# EAGLE design FogMachineTimer_revB (EAGLE 9.5.0)
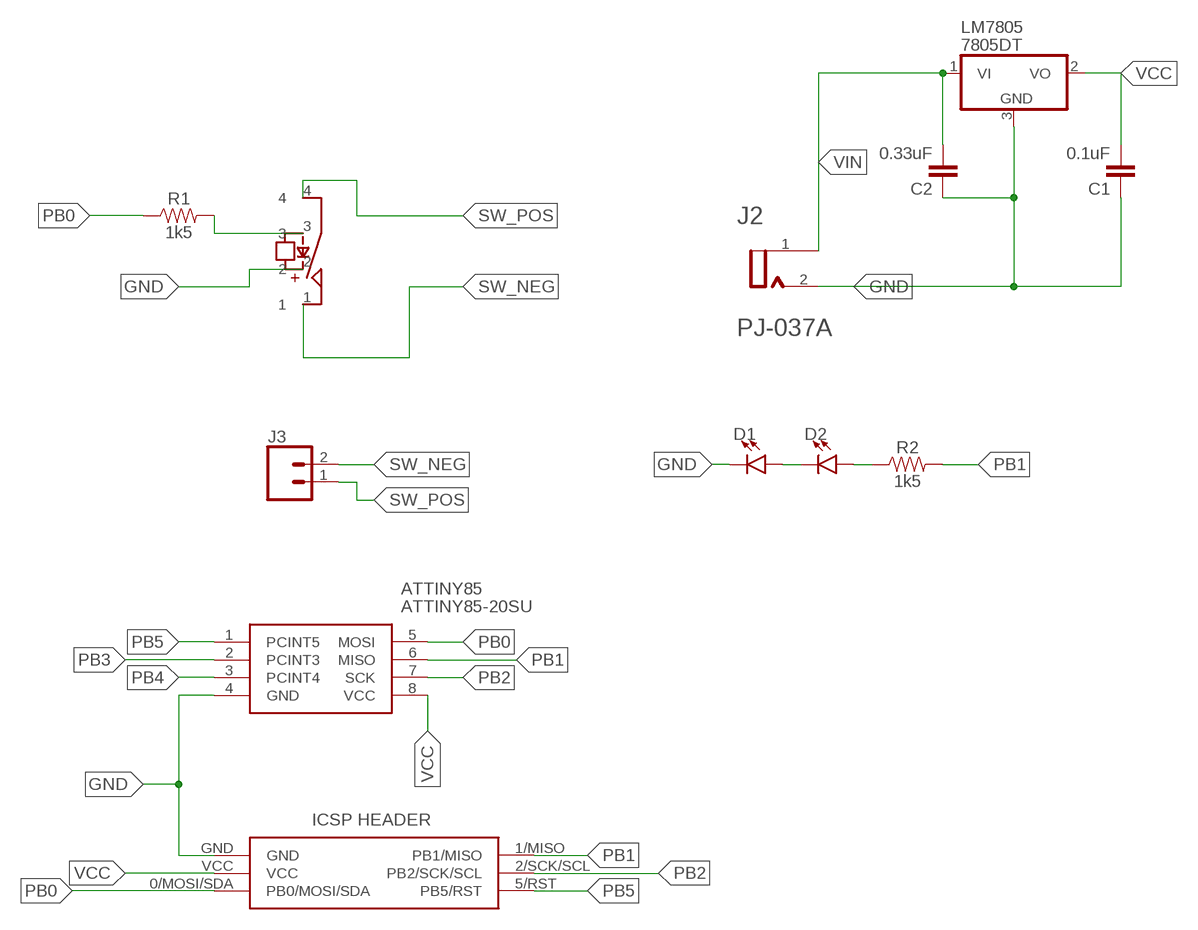
[diagram p0: schematic, sheet 1]

## Parts
ATTINY85  ATTINY85-20SU  [SOT127P798X216-8N]
C1  0.1uF  0.1UF-0603-25V-5%  [0603]
C2  0.33uF  0.1UF-0603-25V-5%  [0603]
D1  LED1206  [LED-1206]
D2  LED1206  [LED-1206]
J1  M20-9980346  [HDRV6W64P254_2X3_762X508X868P]
J2  CUI_PJ-037ACUI_PJ-037A_0_0  [CUI_PJ-037A_0]
J3  CONN_02  [1X02]
LM7805  7805DT  [TO252]
R1  1k5  1KOHM-0603-1/10W-1%  [0603]
R2  1k5  1KOHM-0603-1/10W-1%  [0603]
RELAY  HE3621A0510  [HE3621A0510]

## Nets
GND: ATTINY85.4(GND) C1.1 C2.1 D1.C J1.GND J2.2 LM7805.3(GND) RELAY.2
N$1: D1.A D2.C
N$2: D2.A R2.1
N$3: R1.2 RELAY.3
PB0: ATTINY85.5(MOSI) J1.0/MOSI/SDA(PB0/MOSI/SDA) R1.1
PB1: ATTINY85.6(MISO) J1.1/MISO(PB1/MISO) R2.2
PB2: ATTINY85.7(SCK) J1.2/SCK/SCL(PB2/SCK/SCL)
PB3: ATTINY85.2(PCINT3)
PB4: ATTINY85.3(PCINT4)
PB5: ATTINY85.1(PCINT5) J1.5/RST(PB5/RST)
SW_NEG: J3.2 RELAY.1
SW_POS: J3.1 RELAY.4
VCC: ATTINY85.8(VCC) C1.2 J1.VCC LM7805.2(VO)
VIN: C2.2 J2.1 LM7805.1(VI)

## Library data of the parts
ATTINY85 = NickParts:ATTINY85-20SU: MICROCHIP - ATTINY85-20SU - MICROCONTROLLER MCU, 8 BIT, ATTINY, 20MHZ, SOIC-8 Source: Datasheet <https://componentsearchengine.com/Datasheets/2/ATTINY85-20SU.pdf>; ARROW_PART_NUMBER: ATTINY85-20SU; ARROW_PRICE/STOCK: https://www.arrow.com/en/products/attiny85-20su/microchip-technology; DESCRIPTION: MICROCHIP - ATTINY85-20SU - MICROCONTROLLER MCU, 8 BIT, ATTINY, 20MHZ, SOIC-8; HEIGHT: 2.16mm; MANUFACTURER_NAME: Microchip; MANUFACTURER_PART_NUMBER: ATTINY85-20SU; RS_PART_NUMBER: 1331674; RS_PRICE/STOCK: http://uk.rs-online.com/web/p/products/1331674
C1 = SparkFun-Capacitors:0.1UF: 0.1µF ceramic capacitors A capacitor is a passive two-terminal electrical component used to store electrical energy temporarily in an electric field.; PROD_ID: CAP-08604
C2 = SparkFun-Capacitors:0.1UF: 0.1µF ceramic capacitors A capacitor is a passive two-terminal electrical component used to store electrical energy temporarily in an electric field.; PROD_ID: CAP-08604; VALUE: 0.1uF
D1 D2 = SparkFun-LED:LED: LED (Generic) Standard schematic elements and footprints for 5mm, 3mm, 1206, and 0603 sized LEDs. Generic LEDs with no color specified.
J1 = BadgeParts:M20-9980346: 03+03 DIL Vertical Pin Header HARWIN M20 Series, 2.54mm Pitch 6 Way 2 Row Straight PCB Header, Solder Termination, 3A Source: Datasheet <https://cdn.harwin.com/pdfs/M20-998.pdf?utm_source=3D_PDF&utm_medium=3D_PDF&utm_campaign=3D_PDF>; ARROW_PART_NUMBER: M20-9980346; ARROW_PRICE/STOCK: http://uk.rs-online.com/web/p/products/7457046P; DESCRIPTION: 03+03 DIL Vertical Pin Header HARWIN M20 Series, 2.54mm Pitch 6 Way 2 Row Straight PCB Header, Solder Termination, 3A; HEIGHT: 8.68mm; MANUFACTURER_NAME: HARWIN; MANUFACTURER_PART_NUMBER: M20-9980346; RS_PART_NUMBER: 7457046P; RS_PRICE/STOCK: http://uk.rs-online.com/web/p/products/7457046P
J2 = NickParts:CUI_PJ-037A: DC POWER JACK; CENTROID_NOT_SPECIFIED: No; DATASHEET: http://www.cui.com/product/resource/pj-037a.pdf; DIGIKEY_DESCRIPTION: CONN PWR JACK 2X5.5MM SOLDER; DIGIKEY_PART_NUMBER: CP-037A-ND; LEAD_FREE: yes; MF: CUI; MOUSER_PART_NUMBER: 490-PJ-037A; MPN: PJ-037A; PACKAGE: CONN_PTH_P2; PREFIX: J; ROHS: yes; TEMPERATURE_RANGE_HIGH: +85°C; TEMPERATURE_RANGE_LOW: -25°C; VOLTAGE: 24V
J3 = SparkFun-Connectors:CONN_02: Multi connection point. Often used as Generic Header-pin footprint for 0.1 inch spaced/style header connections On any of the 0.1 inch spaced packages, you can populate with these: Break Away Headers - Straight <https://www.sparkfun.com/products/116> (PRT-00116) Break Away Male Headers - Right Angle <https://www.sparkfun.com/products/553> (PRT-00553) Female Headers <https://www.sparkfun.com/products/115> (PRT-00115) Break Away Headers - Machine Pin <https://www.sparkfun.com/products/117> (PRT-00117) Break Away Female Headers - Swiss Machine Pin <https://www.sparkfun.com/products/743> (PRT-00743) For SCREWTERMINALS and SPRING TERMINALS visit here: Screw Terimnals on SparkFun.com <https://www.sparkfun.com/search/results?term=Screw+Terminals> (5mm/3.5mm/2.54mm spacing) This device is also useful as a general connection point to wire up your design to another part of your project. Our various solder wires solder well into these plated through hole pads. Hook-Up Wire - Assortment (Stranded, 22 AWG) <https://www.sparkfun.com/products/11375> (PRT-11375) Hook-Up Wire - Assortment (Solid Core, 22 AWG) <https://www.sparkfun.com/products/11367> (PRT-11367) View the entire wire category on our website here <https://www.sparkfun.com/categories/141> Special notes: Molex polarized connector foot print use with: PRT-08233 with associated crimp pins and housings. 2.54_SCREWTERM for use with PRT-10571. 3.5mm Screw Terminal footprints for PRT-08084 5mm Screw Terminal footprints for use with PRT-08432
LM7805 = adafruit:78*: Positive VOLTAGE REGULATOR Added bigger pads to the TO-92 package
R1 R2 = SparkFun-Resistors:1KOHM: 1kΩ resistor A resistor is a passive two-terminal electrical component that implements electrical resistance as a circuit element. Resistors act to reduce current flow, and, at the same time, act to lower voltage levels within circuits. - Wikipedia; PROD_ID: RES-07856; VALUE: 1k
RELAY = NickParts:HE3621A0510: Miniature SIL Relay Form A SPST-NO Specifications Contact form: SPST-NO Coil voltage: 5VDC Coil resistance: 500Ω Contact voltage: 200VDC Contact current: 0.5A Size: 0.75"L x 0.20"W x 0.30"H 4-pin package

## Board
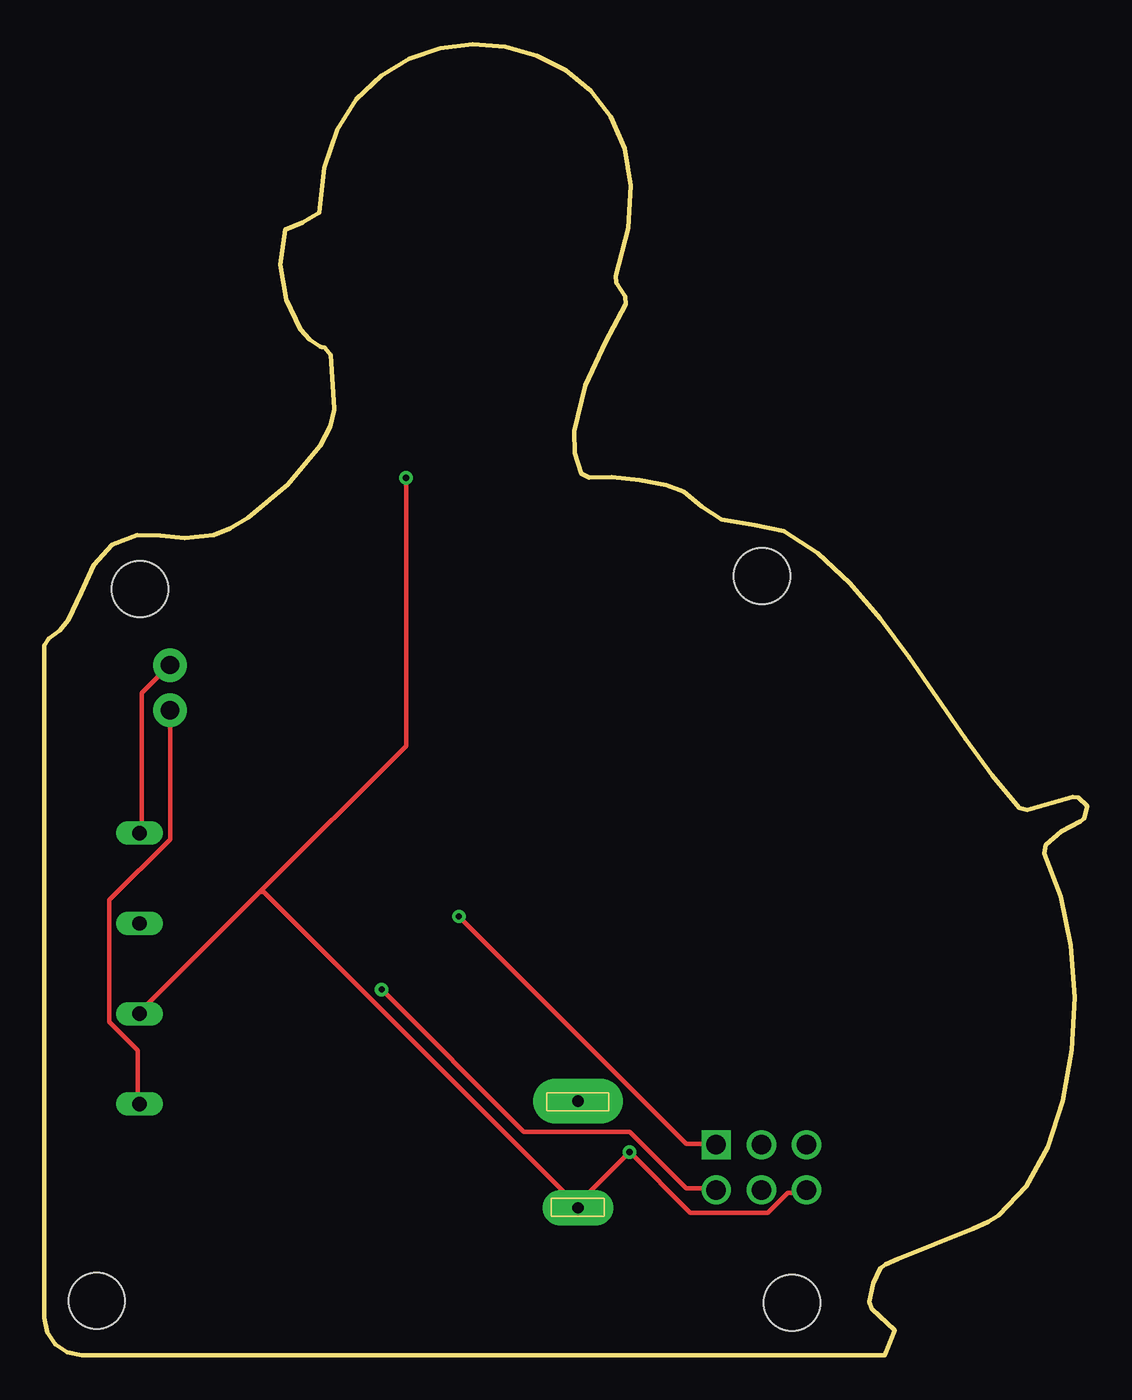
[diagram p1: board, top side]
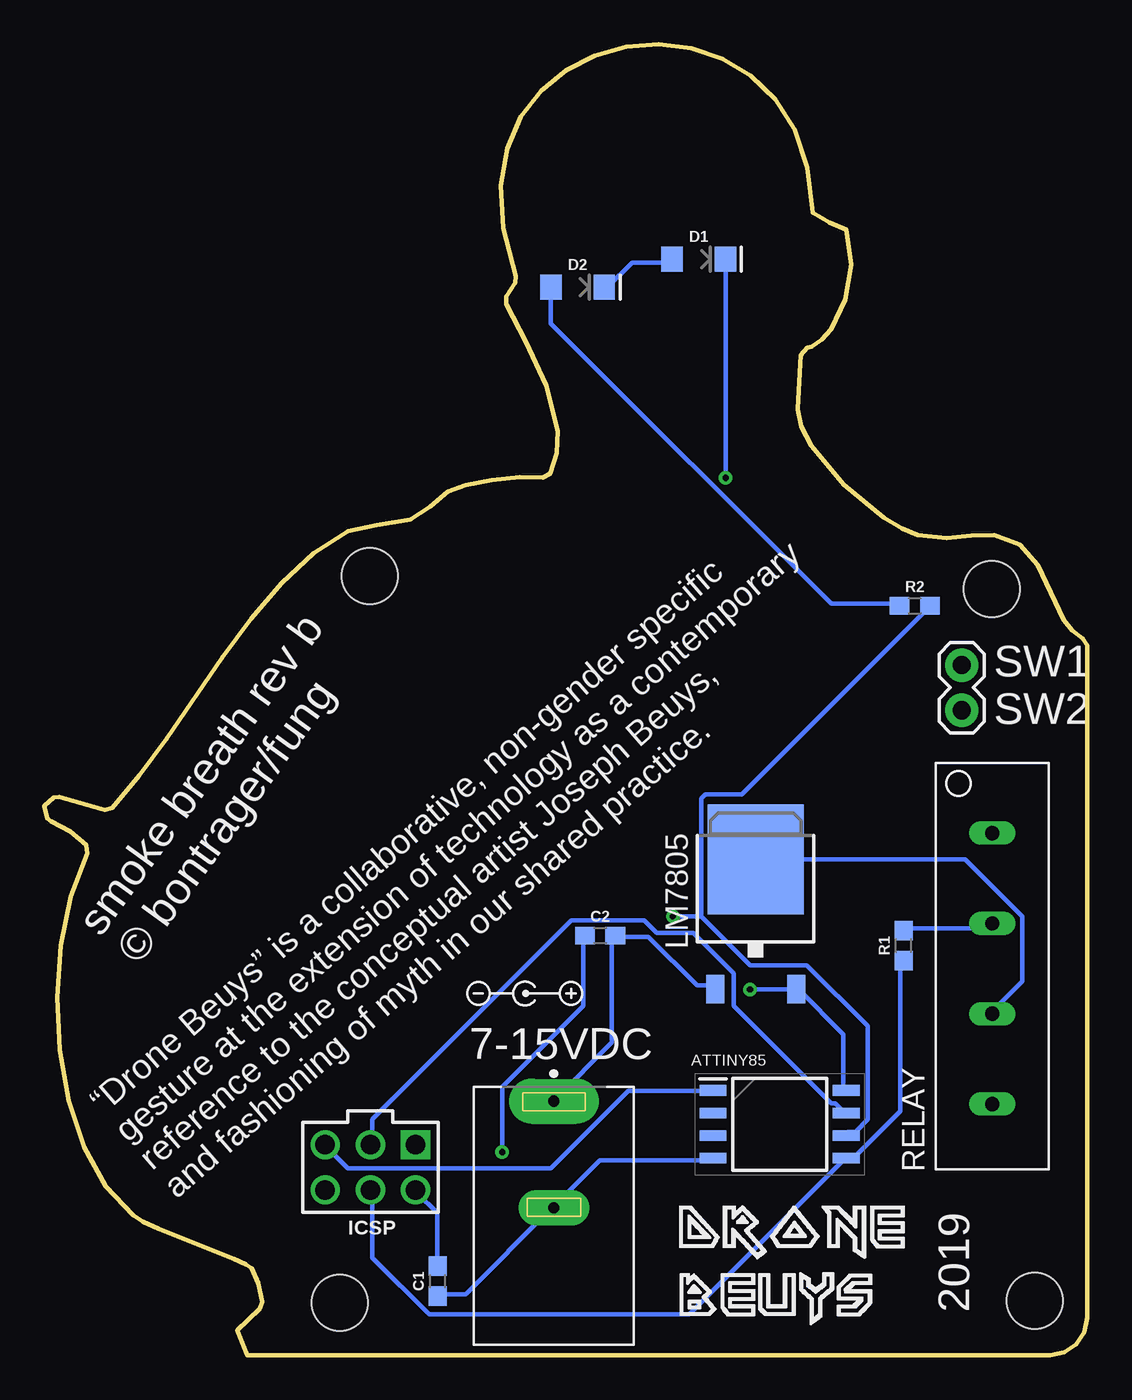
[diagram p2: board, bottom side, seen from below]

Size 58.67 x 73.77 mm. Coordinates in mm from the lower left corner, seen from the top.
Outline: 47.84,1.4 46.55,2.61 46.42,3.01 46.64,4.04 47.01,4.89 47.34,5.11 48.03,5.43 50.06,6.24 52.24,7.11 53.1,7.51 53.68,7.85 55.23,9.51 56.44,11.71 57.3,14.31 57.81,17.17 57.96,20.13 57.75,23.06 57.18,25.81 56.25,28.23 56.33,28.72 57.21,29.47 58.28,30.02 58.52,30.21 58.67,30.91 58.16,31.39 57.85,31.41 55.29,30.68 54.85,30.8 53.33,32.62 51.8,34.71 48.67,39.25 47.03,41.45 45.31,43.46 43.51,45.14 41.59,46.38 39.97,46.73 38.1,47.01 36.98,47.75 35.98,48.6 34.98,48.97 33.5,49.25 31.93,49.4 30.65,49.38 30.21,49.6 29.84,50.76 29.8,51.99 30.44,54.56 31.59,57.04 32.7,59.16 32.68,59.58 32.18,60.36 32.14,60.74 32.85,63.42 33,65.81 32.64,67.9 31.87,69.69 30.73,71.17 29.32,72.32 27.7,73.14 25.94,73.63 24.11,73.77 22.28,73.55 20.54,72.97 18.94,72.01 17.56,70.68 16.47,68.95 15.74,66.83 15.45,64.3 14.5,63.72 13.56,63.33 13.28,61.37 13.61,59.4 14.4,57.75 14.93,57.15 15.52,56.76 15.61,56.73 15.76,56.7 16.11,56.29 16.3,53.27 16.3,53.22 16.09,52.26 15.53,51.19 13.69,48.99 11.46,47.14 10.42,46.51 9.53,46.15 7.9,45.99 6.53,46.13 5.22,46.15 3.81,45.62 2.78,44.47 2.06,42.91 1.33,41.38 0.85,40.77 0.24,40.32 0,39.93 0,2.1 0.17,1.28 0.61,0.61 1.28,0.17 2.1,0 47.27,0 47.84,1.4
Copper layers (1*16): Top 0.035mm / dielectric 1.5mm / Bottom 0.035mm
Design rules "default *": minimum track width 10mil, minimum drill 0.35mm, track to track 8mil, track to pad 8mil, pad to pad 8mil, via to via 8mil, smd to smd 6mil, copper to edge 40mil, drill to drill 6mil, minimum pad ring 10mil, minimum via ring 8mil, stop-mask expansion 4mil, vias tented up to drill 0mil, thermal gap 10mil
Holes 3.17 mm at 2.95,3.06 42.06,2.95 5.38,43.11 40.37,43.85
tRestrict: area 18.6,59.9 to 25,63.1; area 26.4,58.5 to 30.9,62.2
bRestrict: area 21.2,61 to 22.6,62.4; area 28,59.5 to 29.4,60.8

### Footprints (pad centres in the part's own frame; a part is rotated, then mirrored left to right if it is on the bottom)
SOT127P798X216-8N = smd 1.5 x 0.6: 1 -3.75,1.905; 2 -3.75,0.635; 3 -3.75,-0.635; 4 -3.75,-1.905; 5 3.75,-1.905; 6 3.75,-0.635; 7 3.75,0.635; 8 3.75,1.905
0603 = smd 1.1 x 1: 1 -0.85,0; 2 0.85,0
LED-1206 = smd 1.2 x 1.4: A -1.5,0; C 1.5,0
HDRV6W64P254_2X3_762X508X868P = drill 1.1 pad 1.65: 0/MOSI/SDA 0,1.27; 2/SCK/SCL 0,3.81; 5/RST -2.54,3.81; GND -2.54,1.27; VCC 2.54,1.27 | drill 1.1 pad 1.65 square: 1/MISO 2.54,3.81
CUI_PJ-037A_0 = drill 0.635 pad 2.54 long: 1 0,6.45 | drill 0.635 pad 2 long: 2 0,0.45
1X02 = drill 1.016 pad 1.88: 1 0,0; 2 2.54,0
TO252 = smd 1 x 1.6: 1 -2.28,-4.8; 2 2.28,-4.8 | smd 5.4 x 6.2: 3 0,2.5
HE3621A0510 = drill 0.813 long: 1 0,0; 2 0,5.08; 3 0,10.16; 4 0,15.24

### Placement (x,y rotation side)
ATTINY85  17.31,12.99 0 bottom
C1  36.54,4.16 90 bottom
C2  27.41,23.61 0 bottom
D1  21.86,61.68 0 bottom
D2  28.68,60.1 0 bottom
J1  40.34,8.03 0 bottom
J2  30.01,7.84 0 bottom
J3  7.06,38.83 270 bottom
LM7805  18.66,25.4 0 bottom
R1  10.33,23.05 90 bottom
R2  9.7,42.17 0 bottom
RELAY  5.35,14.14 0 bottom
U$1  [5VDC_JACK_SILK]  35.52,19.08 0 bottom
U$2  [DB_LOGO_MAIDEN]  23.76,0.96 0 bottom

### Tracks (layer width: path | path; a pad name or v marks a point on that pad's centre or on a via)
GND  (via drill 0.35)
  Top 0.254: 29.95,8.46 v32.92,11.43 36.35,8 40.69,8 41.83,9.14 42.75,9.14 J1.GND | v20.34,49.38 20.34,34.29 12.12,26.06 | 12.12,26.06 5.49,19.43 RELAY.2 | 29.95,8.46 12.34,26.06 12.12,26.06 | 29.95,8.46 J2.2
  Bottom 0.254: C1.1 36.35,3.43 34.98,3.43 30.18,8.23 J2.2 29.95,8.46 27.43,10.97 21.26,10.97 ATTINY85.4 | v32.92,11.43 32.92,15.09 28.35,19.66 28.35,23.55 C2.1 | v20.34,49.38 20.34,61.49 D1.C | LM7805.3 18.52,27.89 6.86,27.89 3.66,24.69 3.66,21.03 5.26,19.43 RELAY.2
N$1
  Bottom 0.254: D1.A 23.55,61.49 25.6,61.49 26.98,60.12 D2.C
N$2
  Bottom 0.254: R2.1 10.74,42.29 14.4,42.29 30.18,58.06 30.18,59.89 D2.A
N$3
  Bottom 0.254: R1.2 10.29,24 5.71,24 5.49,24.23 RELAY.3
PB0
  Bottom 0.254: R1.1 10.52,22.17 10.52,13.72 13.03,11.2 13.49,11.2 ATTINY85.5 13.72,10.97 22.4,2.29 37.03,2.29 40.23,5.49 40.23,9.14 J1.0/MOSI/SDA
PB1  (via drill 0.35)
  Top 0.254: v23.32,24.69 36.12,11.89 37.72,11.89 J1.1/MISO
  Bottom 0.254: 21.72,24.69 21.72,31.32 21.49,31.55 19.43,31.55 8.91,42.06 R2.2 | 21.72,24.69 18.97,21.95 15.77,21.95 12.34,18.52 12.34,13.26 13.03,12.57 13.49,12.57 ATTINY85.6 | 21.72,24.69 v23.32,24.69
PB2
  Bottom 0.254: ATTINY85.7 13.72,13.72 14.17,14.17 14.4,14.17 19.89,19.66 19.89,21.49 22.17,23.77 24.23,23.77 24.92,24.46 29.03,24.46 40.23,13.26 40.23,11.89 J1.2/SCK/SCL
PB5
  Bottom 0.254: ATTINY85.1 21.26,14.86 25.83,14.86 30.18,10.52 41.6,10.52 42.75,11.66 J1.5/RST
SW_NEG
  Top 0.254: RELAY.1 5.26,14.17 5.26,17.14 3.66,18.75 3.66,25.6 7.09,29.03 7.09,36.12 J3.2
SW_POS
  Top 0.254: RELAY.4 5.49,29.49 5.49,37.26 6.86,38.63 J3.1
VCC  (via drill 0.35)
  Top 0.254: v18.97,20.57 26.98,12.57 32.92,12.57 36.12,9.37 37.72,9.37 J1.VCC
  Bottom 0.254: C1.2 36.58,5.03 36.58,8 37.72,9.14 J1.VCC | ATTINY85.8 13.72,15.09 13.72,18.06 16.23,20.57 LM7805.2 16.46,20.57 v18.97,20.57
VIN
  Bottom 0.254: LM7805.1 21.03,20.8 21.95,20.8 24.69,23.55 26.52,23.55 C2.2 26.75,23.55 26.75,17.6 29.95,14.4 J2.1

### Text on the board
bNames: SW1 / SW2 | smoke breath rev b / © bontrager/fung | 7-15VDC | “Drone Beuys” is a collaborative, non-gender specific / gesture at the extension of technology as a contemporary / reference to the conceptual artist Joseph Beuys, / and fashioning of myth in our shared practice. | 2019